# Altium schematic sheet PulseTrainGenerator.SchDoc
size A4; SheetNumber: 2; SheetTotal: 3
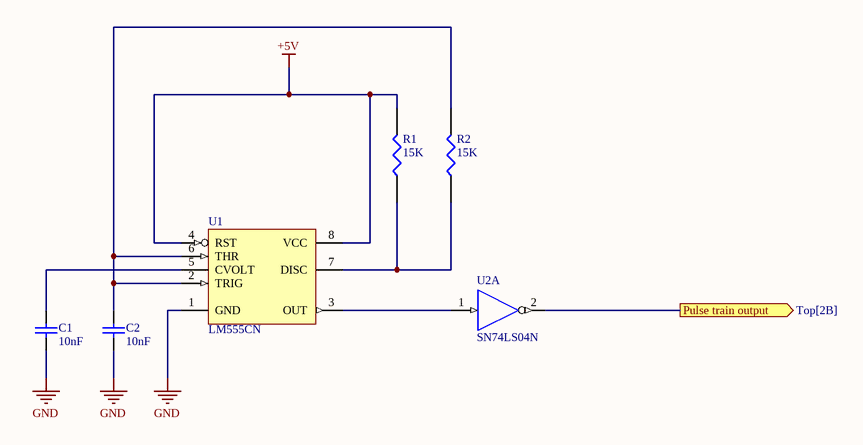
[diagram p0: PulseTrainGenerator.SchDoc]

## Parts
C1  10nF
C2  10nF
R1  15K  [axial0.5]
R2  15K  [axial0.5]
U1  LM555CN  [DIP-8]
U2  SN74LS04N  [DIP14]  (part A of 6)

## Ports
Pulse train output (out, see Top[2B])

## Nets
+5V: R1.2 U1.4(RST) U1.8(VCC)
GND: C1.1 C2.1 U1.1(GND) U2.7(GND)
VCC: U2.14(VCC)
Pulse train output: U2.2(Y) ; port Pulse train output
NetC1_2: C1.2 U1.5(CVOLT)
NetC2_2: C2.2 R2.2 U1.2(TRIG) U1.6(THR)
NetR1_1: R1.1 R2.1 U1.7(DISC)
NetU1_3: U1.3(OUT) U2.1(A)

## Library data of the parts
C1 C2 = Cap: Ceramic Capacitor; Value: 100pF; Published: 8-Jun-2000; LatestRevisionDate: 17-Jul-2002; LatestRevisionNote: Re-released for DXP Platform.; PackageReference: RAD-0.3; Publisher: Altium Limited; PackageDescription: Radial Cap, Thru-Hole; 2 Leads; 0.3 in Pin Spacing
R1 R2 = RES1: Resistor
U1 = LM555CN: Timer; Package Information: Latest Revision: Sep-1997; Published: 15-Apr-2002; Datasheet: Latest Revision: May-1997; Package Reference: N08E; Publisher: Altium Limited
U2 = SN74LS04N: Hex Inverter; Published: 8-Jun-2000; LatestRevisionDate: 04-Mar-2005; LatestRevisionNote: Stylized 3D Model Added.; DatasheetVersion: Mar-1988; PackageVersion: Oct-1995; PackageReference: N014; Publisher: Altium Limited; PackageDescription: DIP; 14 Leads; Row Spacing 7.62 mm; Pitch 2.54 mm; ComponentLink1Description: Manufacturer Link; ComponentLink1URL: http://www.ti.com/; ComponentLink2Description: Datasheet; ComponentLink2URL: http://www-s.ti.com/sc/ds/sn5404.pdf; ComponentLink3Description: Packaging Specification; ComponentLink3URL: http://focus.ti.com/lit/ml/mpdi002c/mpdi002c.pdf